# EAGLE design ModuleTester (EAGLE 7.1.0)
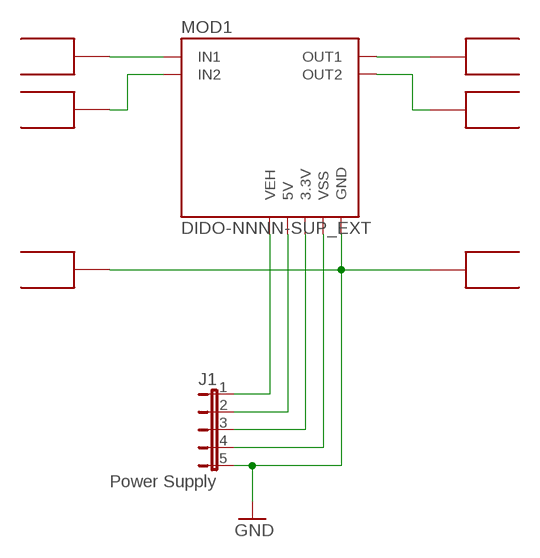
[diagram p0: schematic, sheet 1]

## Parts
J1  Power Supply  JP5E  [JP5]
MOD1  DIDO-NNNN-SUP_EXT  [DIDO-NNNN-SUP_EXT]
U$1  BANANA-PLUGROUND  [6MM-PAD-ROUND]
U$2  BANANA-PLUGROUND  [6MM-PAD-ROUND]
U$3  BANANA-PLUGROUND  [6MM-PAD-ROUND]
U$4  BANANA-PLUGROUND  [6MM-PAD-ROUND]
U$5  BANANA-PLUGROUND  [6MM-PAD-ROUND]
U$6  BANANA-PLUGROUND  [6MM-PAD-ROUND]

## Nets
GND: J1.5 MOD1.GND1(GND) MOD1.GND2(GND) MOD1.GND3(GND) MOD1.GND4(GND) U$5.1 U$6.1
IN1: MOD1.IN1 MOD1.IN2(IN1) MOD1.IN3(IN1) MOD1.IN4(IN1) U$3.1
IN2: MOD1.IN2_1(IN2) MOD1.IN2_2(IN2) MOD1.IN2_3(IN2) MOD1.IN2_4(IN2) U$4.1
N$1: J1.1 MOD1.VEH
N$2: J1.2 MOD1.5V
N$3: J1.3 MOD1.3.3V
N$4: J1.4 MOD1.VSS
OUT1: MOD1.OUT1 MOD1.OUT2(OUT1) MOD1.OUT3(OUT1) MOD1.OUT4(OUT1) U$1.1
OUT2: MOD1.OUT2_1(OUT2) MOD1.OUT2_2(OUT2) MOD1.OUT2_3(OUT2) MOD1.OUT2_4(OUT2) U$2.1

## Library data of the parts
J1 = Jumper_mod:JP5E
MOD1 = AllModules:DIDO-NNNN-SUP_EXT
U$1-U$6 = banana-plug-4mm:BANANA-PLUG

## Board
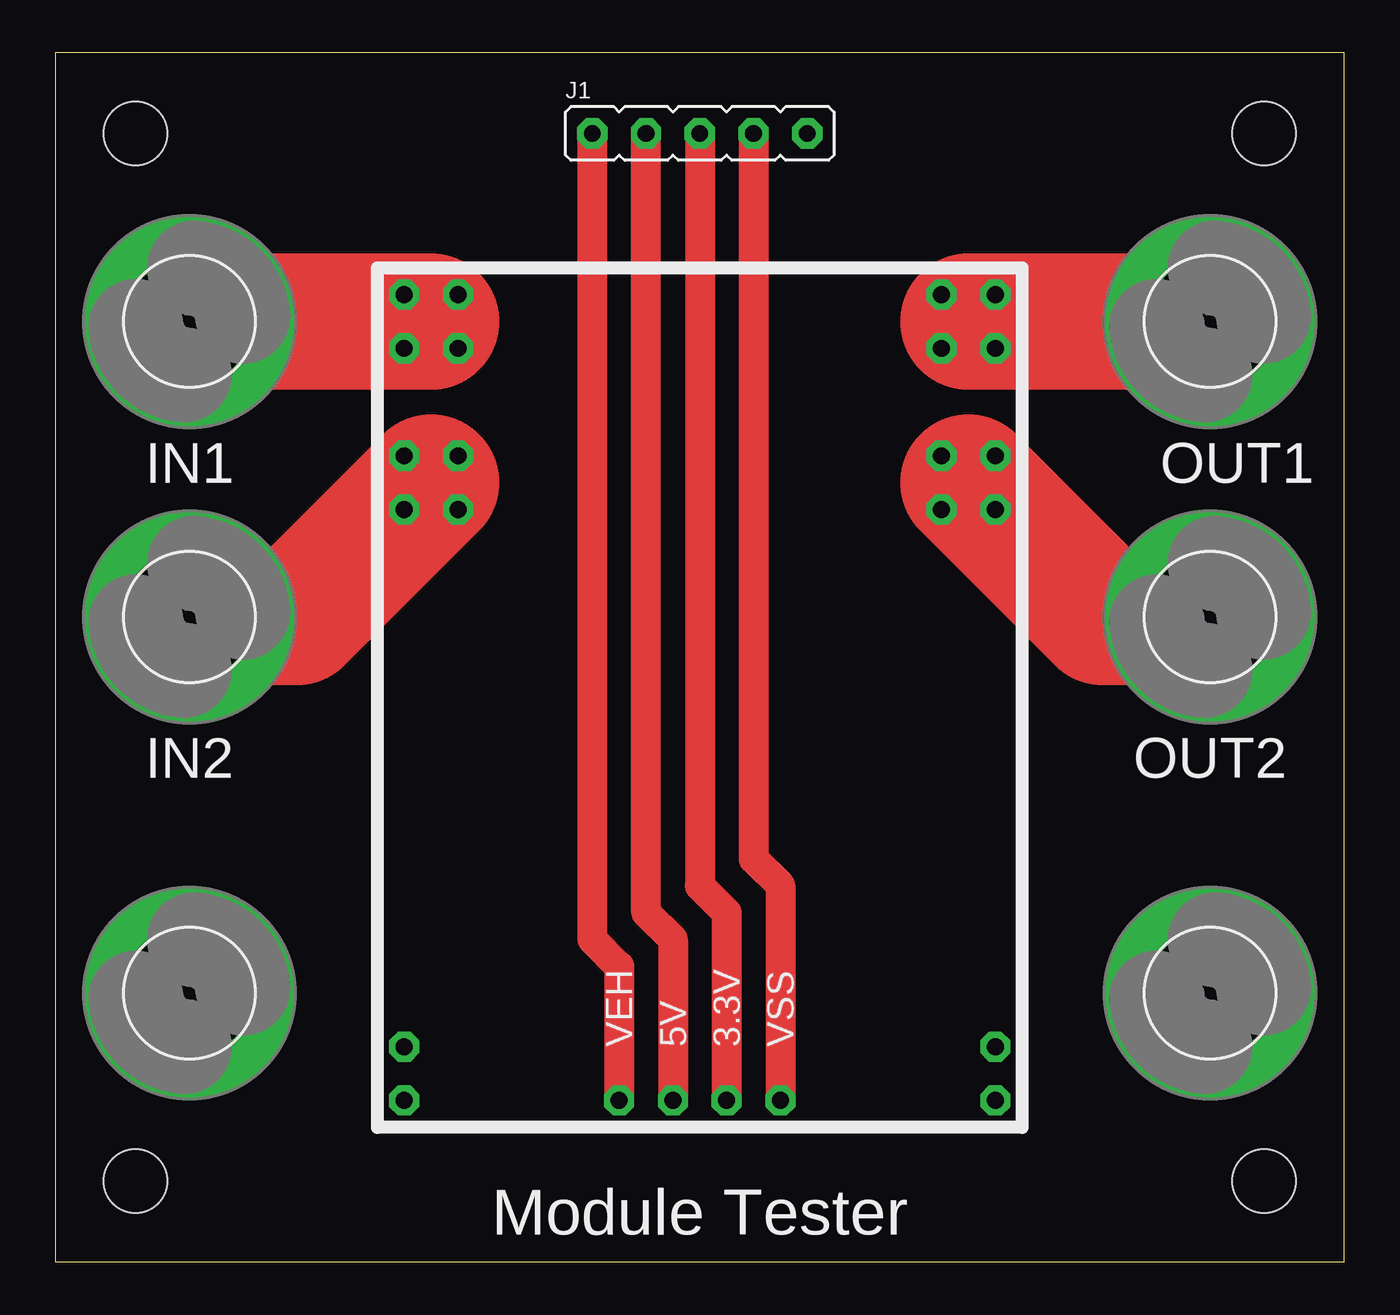
[diagram p1: board, top side]
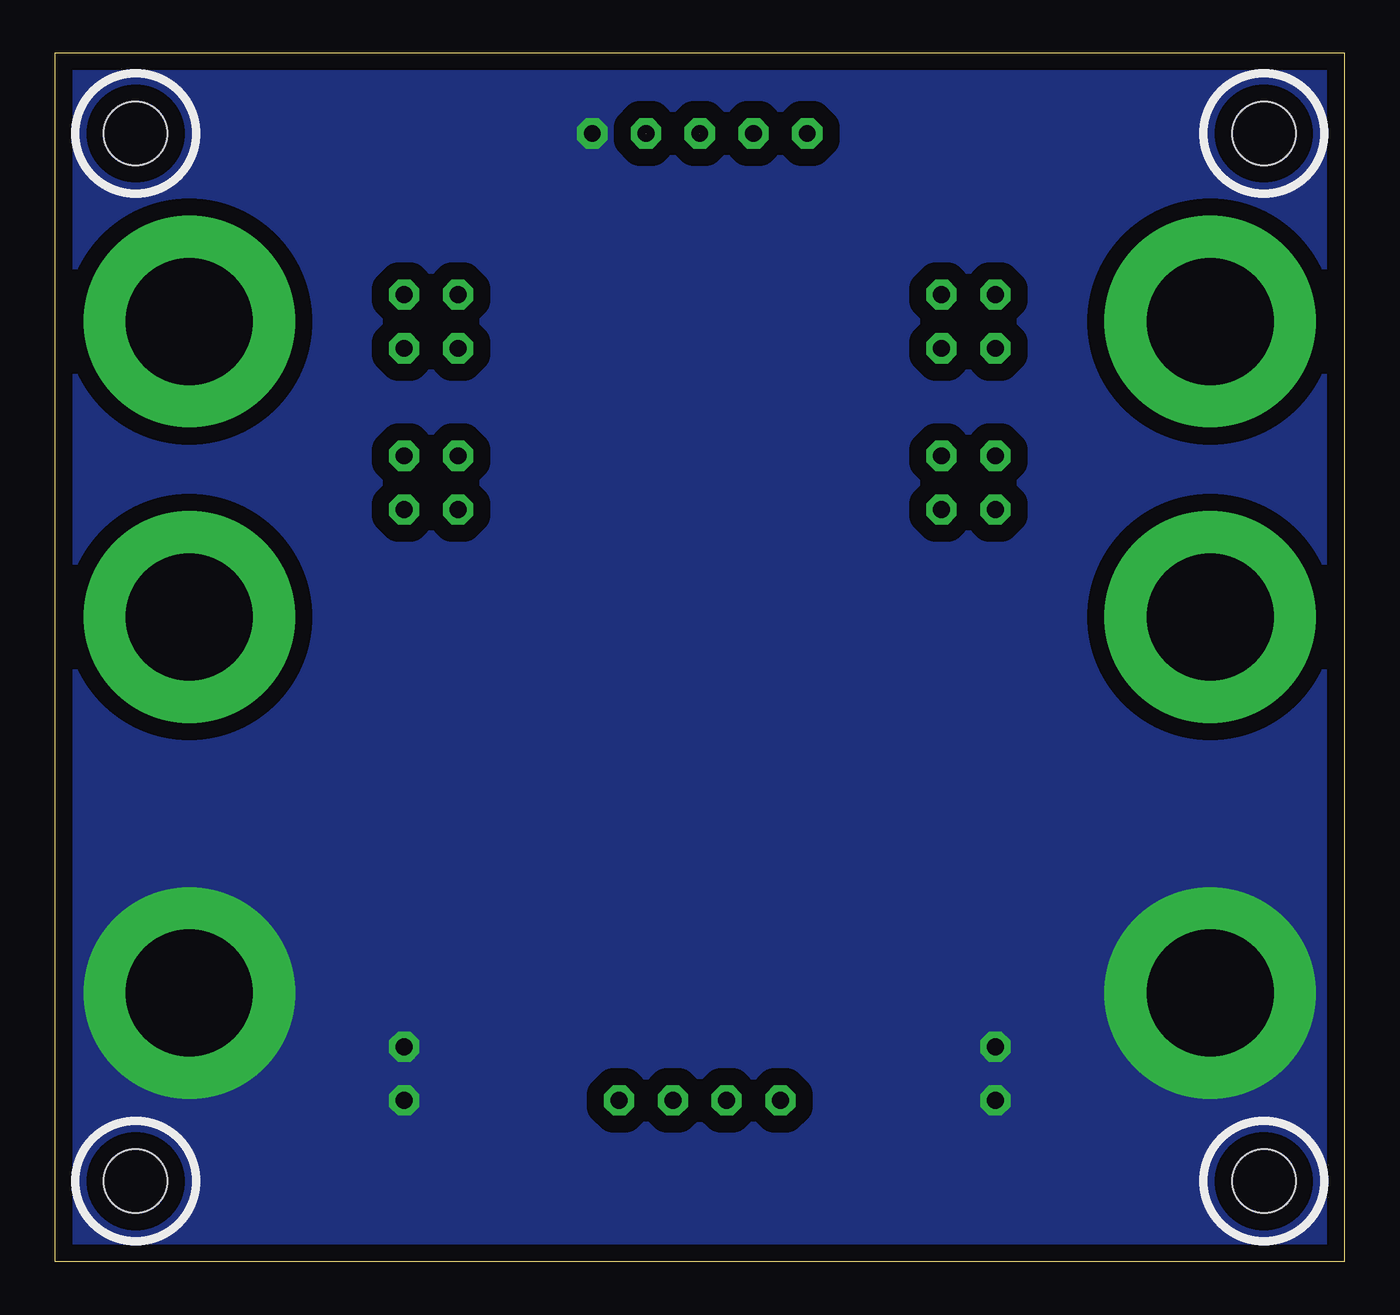
[diagram p2: board, bottom side, seen from below]

Size 60.96 x 57.15 mm. Coordinates in mm from the lower left corner, seen from the top.
Outline: 0,0 60.96,0 60.96,57.15 0,57.15 0,0
Copper layers (1*16): Top 0.035mm / dielectric 1.5mm / Bottom 0.035mm
Design rules "PCB-POOL Standard": minimum track width 0.15mm, minimum drill 0.3mm, track to track 0.15mm, track to pad 0.15mm, pad to pad 0.15mm, via to via 0.15mm, smd to smd 0.15mm, copper to edge 0.3mm, drill to drill 0.2mm, minimum pad ring 0.2mm, minimum via ring 0.15mm, stop-mask expansion 0.075mm, vias tented up to drill 0mil, thermal gap 0.2mm
Holes 3 mm at 3.81,3.81 57.15,3.81 3.81,53.34 57.15,53.34

### Footprints (pad centres in the part's own frame; a part is rotated, then mirrored left to right if it is on the bottom)
JP5 = drill 0.8 pad 1.44 octagon: 1 -5.08,0; 2 -2.54,0; 3 0,0; 4 2.54,0; 5 5.08,0
DIDO-NNNN-SUP_EXT = drill 0.8 pad 1.422 octagon: 3.3V 15.24,-38.1; 5V 12.7,-38.1; GND1 0,-38.1; GND2 0,-35.56; GND3 27.94,-35.56; GND4 27.94,-38.1; IN1 0,0; IN2 0,-2.54; IN2_1 0,-7.62; IN2_2 0,-10.16; IN2_3 2.54,-7.62; IN2_4 2.54,-10.16; IN3 2.54,0; IN4 2.54,-2.54; OUT1 25.4,0; OUT2 25.4,-2.54; OUT2_1 25.4,-7.62; OUT2_2 25.4,-10.16; OUT2_3 27.94,-7.62; OUT2_4 27.94,-10.16; OUT3 27.94,0; OUT4 27.94,-2.54; VEH 10.16,-38.1; VSS 17.78,-38.1
6MM-PAD-ROUND = drill 6 pad 10: 1 0,0

### Placement (x,y rotation side)
J1  30.48,53.34 0 top
MOD1  16.51,45.72 0 top
U$1  54.61,44.45 0 top
U$2  54.61,30.48 0 top
U$3  6.35,44.45 0 top
U$4  6.35,30.48 0 top
U$5  6.35,12.7 0 top
U$6  54.61,12.7 0 top
U$7  [MODULE_OVERLAY]  16.51,45.72 0 top

### Tracks (layer width: path | path; a pad name or v marks a point on that pad's centre or on a via)
GND
  pour Bottom (isolate 0.813, no thermals): -1.27,58.42 -1.27,-1.27 62.23,-1.27 62.23,58.42
IN1
  Top 6.452: U$3.1 17.78,44.45
  pour Top: 16.51,45.72 19.05,45.72 19.05,43.18 16.51,43.18
IN2
  Top 6.452: U$4.1 11.43,30.48 17.78,36.83
  pour Top: 16.51,38.1 19.05,38.1 19.05,35.56 16.51,35.56
N$1
  Top 1.422: MOD1.VEH 26.67,13.97 25.4,15.24 J1.1
N$2
  Top 1.422: MOD1.5V 29.21,15.24 27.95,16.5 27.94,16.5 J1.2
N$3  (1 unrouted)
  Top 1.422: J1.3 30.49,17.77 31.75,16.51 MOD1.3.3V
N$4  (1 unrouted)
  Top 1.422: J1.4 33.03,19.04 34.29,17.78 MOD1.VSS
OUT1
  Top 6.452: U$1.1 43.18,44.45
  pour Top: 41.91,45.72 44.45,45.72 44.45,43.18 41.91,43.18
OUT2
  Top 6.452: U$2.1 49.53,30.48 43.18,36.83
  pour Top: 41.91,38.1 44.45,38.1 44.45,35.56 41.91,35.56

### Text on the board
tNames: IN1 | OUT1 | IN2 | OUT2 | Module Tester
bStop: by Jan Kokert / 25.04.2017